# EAGLE design in4_single_v0.2 (EAGLE 7.5.0)
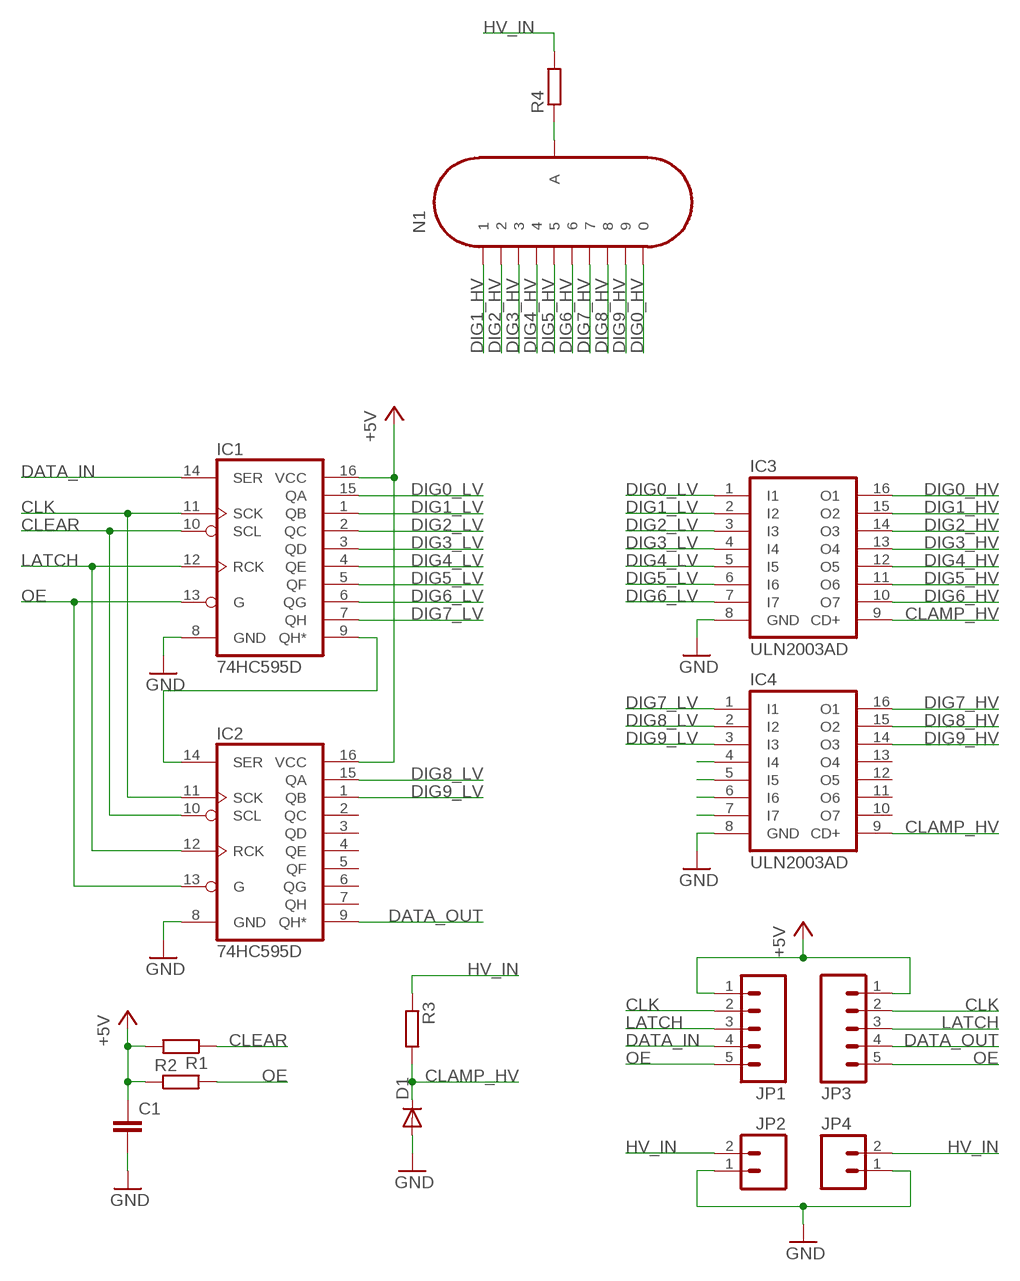
[diagram p0: schematic, sheet 1]

## Parts
C1  C-EUC0805  [C0805]
D1  DIODE-SOD-123  [SOD-123]
IC1  74HC595D  74LS595D  [SO16]
IC2  74HC595D  74LS595D  [SO16]
IC3  ULN2003AD  [SO16]
IC4  ULN2003AD  [SO16]
JP1  M05NO_SILK  [1X05_NO_SILK]
JP2  M021X02_NO_SILK  [1X02_NO_SILK]
JP3  M05NO_SILK  [1X05_NO_SILK]
JP4  M021X02_NO_SILK  [1X02_NO_SILK]
N1  IN-4  [IN-4]
R1  R-EU_R0805  [R0805]
R2  R-EU_R0805  [R0805]
R3  R-EU_R0805  [R0805]
R4  R-EU_0204/7  [0204/7]

## Nets
+5V: C1.1 IC1.16(VCC) IC2.16(VCC) JP1.1 JP3.1 R1.2 R2.1
CLAMP_HV: D1.C IC3.9(CD+) IC4.9(CD+) R3.2
CLEAR: IC1.10(SCL) IC2.10(SCL) R1.1
CLK: IC1.11(SCK) IC2.11(SCK) JP1.2 JP3.2
DATA_IN: IC1.14(SER) JP1.4
DATA_OUT: IC2.9(QH*) JP3.4
DIG0_HV: IC3.16(O1) N1.8
DIG0_LV: IC1.15(QA) IC3.1(I1)
DIG1_HV: IC3.15(O2) N1.14
DIG1_LV: IC1.1(QB) IC3.2(I2)
DIG2_HV: IC3.14(O3) N1.9
DIG2_LV: IC1.2(QC) IC3.3(I3)
DIG3_HV: IC3.13(O4) N1.11
DIG3_LV: IC1.3(QD) IC3.4(I4)
DIG4_HV: IC3.12(O5) N1.1
DIG4_LV: IC1.4(QE) IC3.5(I5)
DIG5_HV: IC3.11(O6) N1.12
DIG5_LV: IC1.5(QF) IC3.6(I6)
DIG6_HV: IC3.10(O7) N1.2
DIG6_LV: IC1.6(QG) IC3.7(I7)
DIG7_HV: IC4.16(O1) N1.6
DIG7_LV: IC1.7(QH) IC4.1(I1)
DIG8_HV: IC4.15(O2) N1.3
DIG8_LV: IC2.15(QA) IC4.2(I2)
DIG9_HV: IC4.14(O3) N1.5
DIG9_LV: IC2.1(QB) IC4.3(I3)
GND: C1.2 D1.A IC1.8(GND) IC2.8(GND) IC3.8(GND) IC4.8(GND) JP2.1 JP4.1
HV_IN: JP2.2 JP4.2 R3.1 R4.2
LATCH: IC1.12(RCK) IC2.12(RCK) JP1.3 JP3.3
N$1: IC1.9(QH*) IC2.14(SER)
N$2: IC4.4(I4)
N$3: IC4.7(I7)
N$4: IC4.6(I6)
N$5: IC4.5(I5)
N$11: N1.4(A) R4.1
OE: IC1.13(G) IC2.13(G) JP1.5 JP3.5 R2.2
Unconnected: IC2.2(QC) IC2.3(QD) IC2.4(QE) IC2.5(QF) IC2.6(QG) IC2.7(QH) IC4.10(O7) IC4.11(O6) IC4.12(O5) IC4.13(O4)

## Library data of the parts
C1 = rcl:C-EU: CAPACITOR, European symbol
D1 = dp_devices:DIODE: Various Diode Packages
IC1 IC2 = SparkFun-DigitalIC:74*595: 8-bit SHIFT REGISTER, output latch; PROD_ID: IC-07875
IC3 IC4 = uln-udn:ULN2003A: DRIVER ARRAY
JP1 JP3 = SparkFun-Connectors:M05: Header 5 Standard 5-pin 0.1" header. Use with straight break away headers (SKU : PRT-00116), right angle break away headers (PRT-00553), swiss pins (PRT-00743), machine pins (PRT-00117), and female headers (PRT-00115). Molex polarized connector foot print use with SKU : PRT-08230 with associated crimp pins and housings.
JP2 JP4 = SparkFun-Connectors:M02: Standard 2-pin 0.1" header. Use with - straight break away headers ( PRT-00116) - right angle break away headers (PRT-00553) - swiss pins (PRT-00743) - machine pins (PRT-00117) - female headers (PRT-00115) Molex polarized connector foot print use with: PRT-08233 with associated crimp pins and housings. 2.54_SCREWTERM for use with PRT-10571. 3.5mm Screw Terminal footprints for PRT-08084 5mm Screw Terminal footprints for use with PRT-08432
N1 = russian-nixies:IN-4: IN-4: large numeric topview nixie tube
R1-R3 = rcl:R-EU_: RESISTOR, European symbol
R4 = resistor:R-EU_: RESISTOR, European symbol

## Board
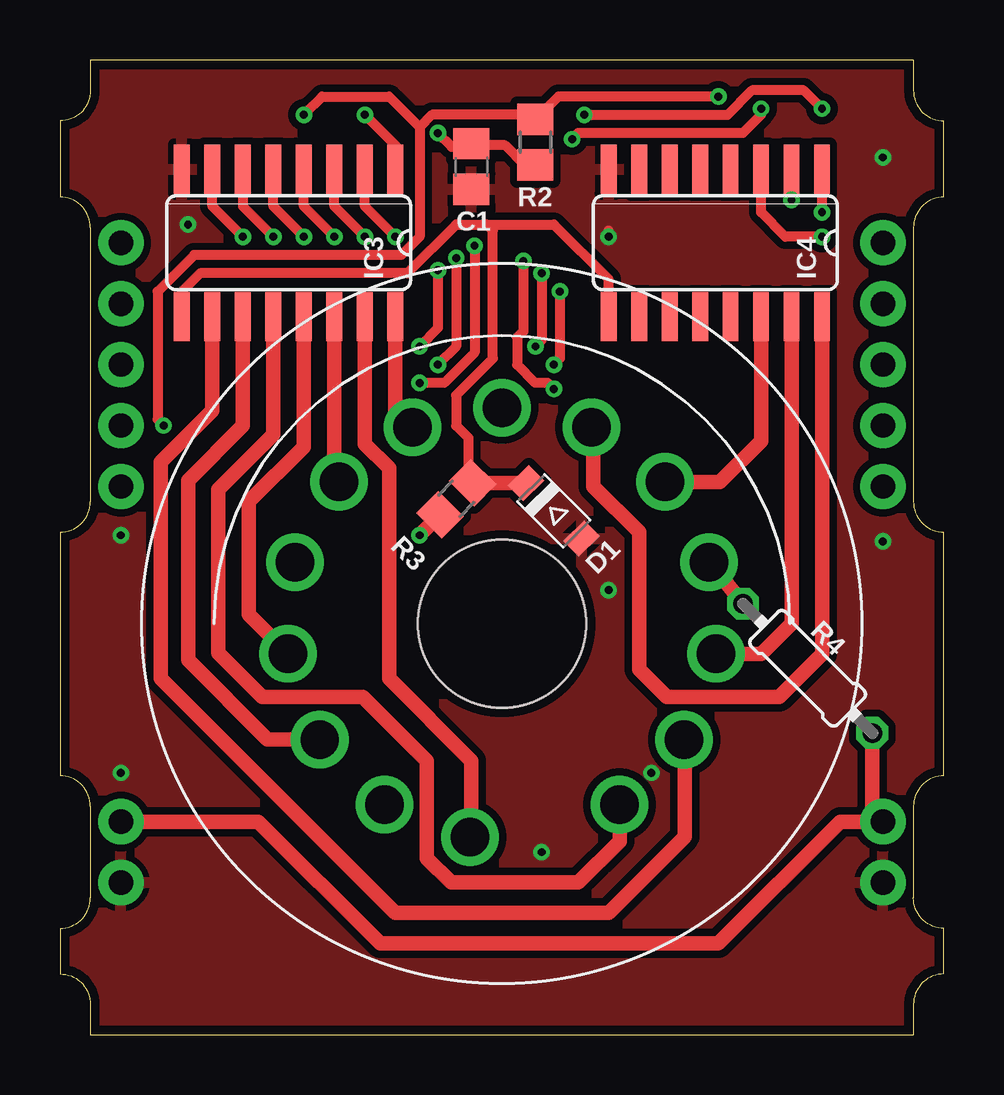
[diagram p1: board, top side]
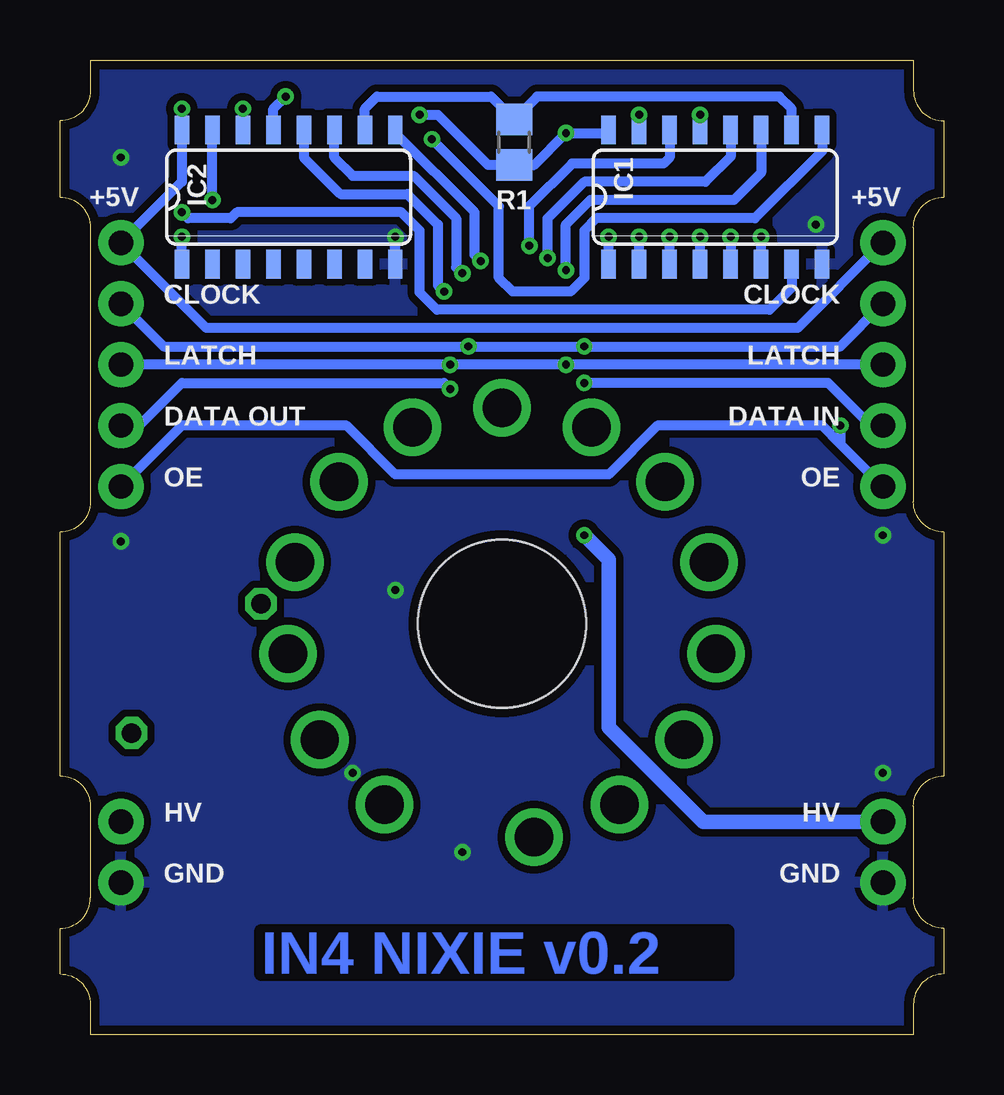
[diagram p2: board, bottom side, seen from below]

Size 36.83 x 40.64 mm. Coordinates in mm from the lower left corner, seen from the top.
Outline: 1.27,0 35.56,0 35.56,1.27 arc-90 36.83,2.54 36.83,4.45 arc-90 35.56,5.71 35.56,9.53 arc-90 36.83,10.79 36.83,20.95 arc-90 35.56,22.23 35.56,33.66 arc-90 36.83,34.92 36.83,38.1 arc-90 35.56,39.37 35.56,40.64 1.27,40.64 1.27,39.37 arc-90 0,38.1 0,34.92 arc-90 1.27,33.66 1.27,22.23 arc-90 0,20.95 0,10.79 arc-90 1.27,9.53 1.27,5.71 arc-90 0,4.45 0,2.54 arc-90 1.27,1.27 1.27,0
Copper layers (1*16): Top 0.0356mm / dielectric 1.5288mm / Bottom 0.0356mm
Design rules "OSHPARK_mod *": minimum track width 6mil, minimum drill 13mil, track to track 6mil, track to pad 6mil, pad to pad 6mil, via to via 6mil, smd to smd 0mil, copper to edge 15mil, drill to drill 6mil, minimum pad ring 10mil, minimum via ring 7mil, stop-mask expansion 3mil, vias tented up to drill 20mil, thermal gap 10mil

### Footprints (pad centres in the part's own frame; a part is rotated, then mirrored left to right if it is on the bottom)
C0805 = smd 1.3 x 1.5: 1 -0.95,0; 2 0.95,0
SOD-123 = smd 0.91 x 1.22: A 1.635,0; C -1.635,0
SO16 = smd 0.6 x 1.2: 1 -4.445,-2.8; 2 -3.175,-2.8; 3 -1.905,-2.8; 4 -0.635,-2.8; 5 0.635,-2.8; 6 1.905,-2.8; 7 3.175,-2.8; 8 4.445,-2.8; 9 4.445,2.8; 10 3.175,2.8; 11 1.905,2.8; 12 0.635,2.8; 13 -0.635,2.8; 14 -1.905,2.8; 15 -3.175,2.8; 16 -4.445,2.8
SO16' = smd 0.66 x 2.032: 1 -4.445,-3.073; 2 -3.175,-3.073; 3 -1.905,-3.073; 4 -0.635,-3.073; 5 0.635,-3.073; 6 1.905,-3.073; 7 3.175,-3.073; 8 4.445,-3.073; 9 4.445,3.073; 10 3.175,3.073; 11 1.905,3.073; 12 0.635,3.073; 13 -0.635,3.073; 14 -1.905,3.073; 15 -3.175,3.073; 16 -4.445,3.073
1X05_NO_SILK = drill 1.016 pad 1.88: 1 0,0; 2 2.54,0; 3 5.08,0; 4 7.62,0; 5 10.16,0
1X02_NO_SILK = drill 1.016 pad 1.88: 1 0,0; 2 2.54,0
IN-4 = drill 1.6: 1 4.902,-7.548; 2 7.59,-4.836; 3 8.912,-1.253; 4 8.629,2.556; 5 6.792,5.904; 6 3.732,8.19; 7 0,9; 8 -3.732,8.19; 9 -6.792,5.904; 10 -8.629,2.556; 11 -8.912,-1.253; 12 -7.59,-4.836; 13 -4.902,-7.548; 14 -1.33,-8.901 | hole 7: 0,0
R0805 = smd 1.3 x 1.5: 1 -0.95,0; 2 0.95,0
0204/7 = drill 0.813 octagon: 1 -3.81,0; 2 3.81,0

### Placement (x,y rotation side)
C1  17.14,36.2 270 top
D1  20.57,21.84 315 top
IC1  9.53,34.92 0 bottom
IC2  27.3,34.92 0 bottom
IC3  ULN2003AD  [SO16']  9.53,33.02 180 top
IC4  ULN2003AD  [SO16']  27.3,33.02 180 top
JP1  2.54,33.02 270 top
JP2  2.54,6.35 90 top
JP3  34.29,33.02 270 top
JP4  34.29,6.35 90 top
N1  18.41,17.14 0 top
R1  17.91,37.21 270 bottom
R2  19.81,37.21 90 top
R3  16.51,22.35 45 top
R4  31.15,15.28 315 top

### Tracks (layer width: path | path; a pad name or v marks a point on that pad's centre or on a via)
+5V  (via drill 0.33)
  Top 0.406: v15.75,37.59 16.32,37.02 C1.1 17.21,37.08 18.54,37.08 19.36,36.26 R2.1 | v21.84,38.35 27.81,38.35 28.83,39.37 30.99,39.37 v31.75,38.61
  Bottom 0.406: JP1.1 6.1,29.46 30.73,29.46 JP3.1 31.75,35.56 IC2.16 v31.75,38.61 | IC1.16 14.1,37.59 v15.75,37.59 17.08,36.26 R1.2 18.99,36.26 21.08,38.35 v21.84,38.35
CLAMP_HV
  Top 0.406: IC4.9 22.86,31.5 20.57,33.78 17.78,33.78 | IC3.9 5.08,30.99 5.84,31.75 14.48,31.75 16.51,33.78 17.78,33.78 | 17.78,33.78 18.03,33.53 18.03,28.19 16.51,26.67 16.51,25.4 17.02,24.89 17.02,23.19 R3.2
  Top 0.61: D1.C 17.2,23 R3.2
CLEAR
  Bottom 0.406: IC2.10 24.13,38.61 23.62,39.12 18.86,39.12 R1.1 16.95,39.12 6.86,39.12 6.35,38.61 IC1.10
CLK  (via drill 0.33)
  Top 0.406: v20.07,31.75 20.07,28.96 v19.81,28.7 | v15.75,31.88 15.75,29.46 v14.99,28.7
  Bottom 0.406: JP3.2 32.51,28.7 v19.81,28.7 v14.99,28.7 4.32,28.7 JP1.2 | v20.07,31.75 20.32,32 20.32,34.04 22.1,35.81 24.64,35.81 25.4,36.58 IC2.11 | IC1.11 7.62,35.93 8.76,34.8 14.73,34.8 15.75,33.78 v15.75,31.88
DATA_IN  (via drill 0.33)
  Top 0.406: v17.27,32.89 17.27,28.45 16,27.18 v14.99,27.18
  Bottom 0.406: JP1.4 3.05,25.4 4.83,27.18 v14.99,27.18 | IC1.14 11.43,36.58 11.68,36.32 15.49,36.32 17.27,34.54 v17.27,32.89
DATA_OUT  (via drill 0.33)
  Top 0.406: v20.57,26.92 20.32,27.18 19.81,27.18 19.05,27.94 19.05,29.08 19.3,29.34 v19.3,32.26
  Bottom 0.406: 22.86,38.1 IC2.9 22.86,37.59 19.56,34.29 19.56,32.51 v19.3,32.26 | JP3.4 33.53,25.4 31.75,27.18 20.83,27.18 v20.57,26.92
DIG0_HV
  Top 0.61: IC3.16 13.97,26.05 N1.8
DIG0_LV  (via drill 0.33)
  Top 0.406: IC3.1 13.97,37.08 v12.7,38.35
  Bottom 0.406: v12.7,38.35 IC1.15
DIG1_HV
  Top 0.61: N1.14 17.14,8.3 17.14,11.43 13.72,14.86 13.72,23.62 12.7,24.64 IC3.15
DIG1_LV  (via drill 0.33)
  Top 0.406: v13.97,33.27 12.7,34.54 IC3.2
  Bottom 0.406: 13.97,31.75 IC1.1 v13.97,33.27
DIG2_HV
  Top 0.61: IC3.14 11.43,23.24 N1.9
DIG2_LV  (via drill 0.33)
  Top 0.406: v12.7,33.27 11.43,34.54 IC3.3
  Bottom 0.406: IC1.2 v12.7,33.27
DIG3_HV
  Top 0.61: N1.11 7.87,17.52 7.87,22.23 10.16,24.51 IC3.13
DIG3_LV  (via drill 0.33)
  Top 0.406: v11.43,33.27 10.16,34.54 IC3.4
  Bottom 0.406: IC1.3 v11.43,33.27
DIG4_HV
  Top 0.61: N1.1 23.32,8.08 21.59,6.35 16.31,6.35 15.29,7.37 15.29,11.43 12.62,14.1 8.43,14.1 6.6,15.93 6.6,22.73 8.89,25.02 IC3.12
DIG4_LV  (via drill 0.33)
  Top 0.406: v10.16,33.27 8.89,34.54 IC3.5
  Bottom 0.406: IC1.4 v10.16,33.27
DIG5_HV
  Top 0.61: IC3.11 7.62,25.4 5.33,23.11 5.33,15.62 8.65,12.31 N1.12
DIG5_LV  (via drill 0.33)
  Top 0.406: IC3.6 7.62,34.54 v8.89,33.27
  Bottom 0.406: v8.89,33.27 IC1.5
DIG6_HV
  Top 0.61: N1.2 26.04,12.28 26.04,8.26 22.86,5.08 13.97,5.08 4.19,14.86 4.19,23.88 6.35,26.04 IC3.10
DIG6_LV  (via drill 0.33)
  Top 0.406: IC3.7 6.35,34.54 v7.62,33.27
  Bottom 0.406: IC1.6 v7.62,33.27
DIG7_HV
  Top 0.61: N1.6 22.23,25.26 22.23,22.86 24.13,20.95 24.13,15.24 25.27,14.1 29.97,14.1 31.75,15.88 IC4.16
DIG7_LV  (via drill 0.33)
  Top 0.406: v31.75,34.29 IC4.1
  Bottom 0.406: IC1.7 6.35,31.14 7.27,30.23 21.13,30.23 21.84,30.94 21.84,33.53 22.61,34.29 29.46,34.29 29.72,34.04 31.5,34.04 v31.75,34.29
DIG8_HV
  Top 0.61: IC4.15 30.48,17.14 29.21,15.88 27.34,15.88 N1.3
DIG8_LV  (via drill 0.33)
  Top 0.406: IC4.2 v30.48,34.8
  Bottom 0.406: v30.48,34.8 IC2.15
DIG9_HV
  Top 0.61: IC4.14 29.21,24.77 27.49,23.05 N1.5
DIG9_LV  (via drill 0.33)
  Top 0.406: IC4.3 29.21,34.29 30.23,33.27 v31.75,33.27
  Bottom 0.406: IC2.1 v31.75,33.27
GND  (via drill 0.33)
  Top 0.406: v22.86,33.27 22.86,33.53
  Bottom 0.406: IC2.8 v22.86,33.27
  other vias: 5.33,33.78 34.29,20.57 22.86,18.54 2.54,20.83 2.54,10.92 20.07,7.62 24.64,10.92 34.29,36.58
  pour Top (isolate 0.305, rank 6): 0,40.64 36.83,40.64 36.83,0 0,0
  pour Bottom (isolate 0.305): 0,40.64 36.83,40.64 36.83,0 0,0
HV_IN  (via drill 0.33)
  Top 0.61: JP2.2 8.26,8.89 13.34,3.81 27.43,3.81 32.51,8.89 JP4.2 33.85,9.33 R4.2 | R3.1 v14.99,20.83
  Bottom 0.61: JP2.2 10.03,8.89 13.97,12.83 13.97,19.81 v14.99,20.83
LATCH  (via drill 0.33)
  Top 0.406: v20.83,30.99 20.83,28.19 v20.57,27.94 | v16.51,32.38 16.51,28.7 v15.75,27.94
  Bottom 0.406: JP1.3 v15.75,27.94 v20.57,27.94 JP3.3 | IC2.12 26.67,36.58 25.15,35.05 22.35,35.05 21.08,33.78 21.08,31.24 v20.83,30.99 | IC1.12 8.89,36.61 9.94,35.56 14.99,35.56 16.51,34.04 v16.51,32.38
N$1  (via drill 0.33)
  Top 0.406: v29.21,38.61 29.21,38.35 28.45,37.59 21.59,37.59 v21.34,37.34
  Bottom 0.406: IC1.9 5.08,36.83 7.87,34.04 14.48,34.04 14.99,33.53 14.99,31.56 15.55,30.99 17.97,30.99 18.54,31.56 18.54,34.54 v21.34,37.34 | IC2.14 v29.21,38.61
N$11
  Top 0.61: N1.4 27.04,19.74 R4.1
OE  (via drill 0.33)
  Top 0.406: v10.16,38.35 10.92,39.12 13.72,39.12 14.99,37.85 | v27.43,39.12 20.77,39.12 R2.2 19.62,38.35 15.49,38.35 14.99,37.85 | v4.32,25.4 4.06,25.65 4.06,30.99 5.59,32.51 14.22,32.51 14.99,33.27 14.99,37.85
  Bottom 0.406: v27.43,39.12 27.94,38.61 IC2.13 | v10.16,38.35 IC1.13 | JP1.5 4.32,24.64 | 4.32,24.64 5.08,25.4 11.94,25.4 13.97,23.37 22.86,23.37 24.89,25.4 31.75,25.4 JP3.5 | v4.32,25.4 4.32,24.64

### Text on the board
Bottom: IN4 NIXIE v0.2
bPlace: +5V | +5V | CLOCK | CLOCK | LATCH | LATCH | DATA IN | DATA OUT | OE | OE | HV | HV | GND | GND
bStop: IN4 NIXIE v0.2